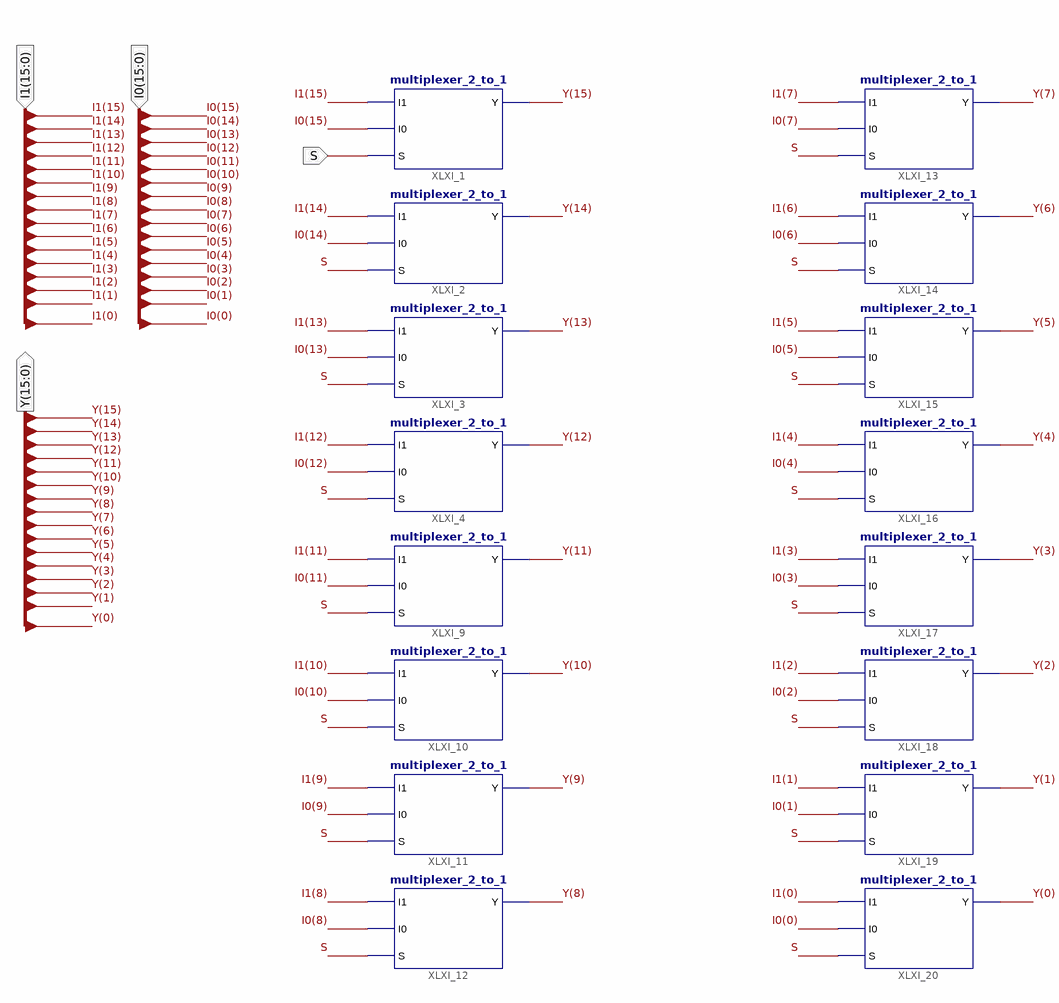
[diagram p0: schematic sheet 1]
// Xilinx ISE schematic multiplexer_2_to_1_16_bit.sch (virtex6) as structural Verilog: 16 symbols, 4 ports
module multiplexer_2_to_1_16_bit (
  input  S,
  input  [15:0] I1,
  input  [15:0] I0,
  output [15:0] Y
);

  multiplexer_2_to_1 XLXI_1 (.I0(I0[15]), .I1(I1[15]), .S(S), .Y(Y[15]));
  multiplexer_2_to_1 XLXI_2 (.I0(I0[14]), .I1(I1[14]), .S(S), .Y(Y[14]));
  multiplexer_2_to_1 XLXI_3 (.I0(I0[13]), .I1(I1[13]), .S(S), .Y(Y[13]));
  multiplexer_2_to_1 XLXI_4 (.I0(I0[12]), .I1(I1[12]), .S(S), .Y(Y[12]));
  multiplexer_2_to_1 XLXI_9 (.I0(I0[11]), .I1(I1[11]), .S(S), .Y(Y[11]));
  multiplexer_2_to_1 XLXI_10 (.I0(I0[10]), .I1(I1[10]), .S(S), .Y(Y[10]));
  multiplexer_2_to_1 XLXI_11 (.I0(I0[9]), .I1(I1[9]), .S(S), .Y(Y[9]));
  multiplexer_2_to_1 XLXI_12 (.I0(I0[8]), .I1(I1[8]), .S(S), .Y(Y[8]));
  multiplexer_2_to_1 XLXI_13 (.I0(I0[7]), .I1(I1[7]), .S(S), .Y(Y[7]));
  multiplexer_2_to_1 XLXI_14 (.I0(I0[6]), .I1(I1[6]), .S(S), .Y(Y[6]));
  multiplexer_2_to_1 XLXI_15 (.I0(I0[5]), .I1(I1[5]), .S(S), .Y(Y[5]));
  multiplexer_2_to_1 XLXI_16 (.I0(I0[4]), .I1(I1[4]), .S(S), .Y(Y[4]));
  multiplexer_2_to_1 XLXI_17 (.I0(I0[3]), .I1(I1[3]), .S(S), .Y(Y[3]));
  multiplexer_2_to_1 XLXI_18 (.I0(I0[2]), .I1(I1[2]), .S(S), .Y(Y[2]));
  multiplexer_2_to_1 XLXI_19 (.I0(I0[1]), .I1(I1[1]), .S(S), .Y(Y[1]));
  multiplexer_2_to_1 XLXI_20 (.I0(I0[0]), .I1(I1[0]), .S(S), .Y(Y[0]));
endmodule
